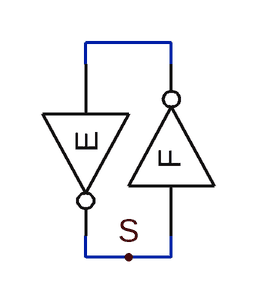
[diagram p0: schematic Stat.asc]
Stat.asc, the LTspice schematic file:
Version 4
SHEET 1 880 680
WIRE 464 144 400 144
WIRE 400 160 400 144
WIRE 464 160 464 144
WIRE 400 304 400 288
WIRE 432 304 400 304
WIRE 464 304 432 304
WIRE 464 304 464 288
FLAG 432 304 S
SYMBOL inverter 400 224 R90
WINDOW 3 0 0 Invisible 2
WINDOW 0 -14 -1 Left 2
SYMATTR InstName E
SYMATTR SpiceLine W={E}
SYMBOL inverter 464 224 R270
WINDOW 3 0 0 Invisible 2
WINDOW 0 -14 -1 Left 2
SYMATTR InstName F
SYMATTR SpiceLine W={F}

The netlist it stands for:
* Stat.asc
XE N001 S inverter W={E}  ; pins IN OUT
XF S N001 inverter W={F}  ; pins IN OUT
.backanno
.end